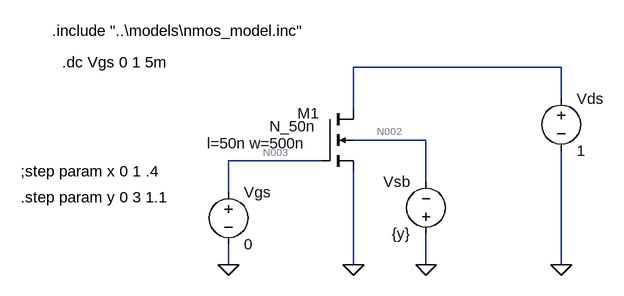
[diagram p0: schematic threshold_bodyeffects.asc]
threshold_bodyeffects.asc, the LTspice schematic file:
Version 4.1
SHEET 1 880 680
WIRE 560 64 240 64
WIRE 560 112 560 64
WIRE 240 128 240 64
WIRE 352 176 240 176
WIRE 192 208 48 208
WIRE 352 240 352 176
WIRE 48 256 48 208
WIRE 48 368 48 336
WIRE 240 368 240 224
WIRE 352 368 352 320
WIRE 560 368 560 192
FLAG 48 368 0
FLAG 240 368 0
FLAG 560 368 0
FLAG 352 368 0
SYMBOL nmos4 192 128 R0
WINDOW 0 -38 7 Left 2
WINDOW 3 -81 27 Left 2
WINDOW 123 -177 53 Left 2
SYMATTR InstName M1
SYMATTR Value N_50n
SYMATTR Value2 l=50n w=500n
SYMBOL voltage 48 240 R0
SYMATTR InstName Vgs
SYMATTR Value 0
SYMBOL voltage 560 96 R0
SYMATTR InstName Vds
SYMATTR Value 1
SYMBOL voltage 352 336 R180
WINDOW 0 24 96 Left 2
WINDOW 3 24 16 Left 2
SYMATTR InstName Vsb
SYMATTR Value {y}
TEXT -224 8 Left 2 !.include "..\\models\\nmos_model.inc"
TEXT -208 56 Left 2 !.dc Vgs 0 1 5m
TEXT -272 224 Left 2 !;step param x 0 1 .4
TEXT -272 264 Left 2 !.step param y 0 3 1.1

The netlist it stands for:
* threshold_bodyeffects.asc
M1 N001 N003 0 N002 N_50n l=50n w=500n
Vgs N003 0 0
Vds N001 0 1
Vsb 0 N002 {y}
.model NMOS NMOS
.model PMOS PMOS
.lib standard.mos
.include "..\models\nmos_model.inc"
.dc Vgs 0 1 5m
;step param x 0 1 .4
.step param y 0 3 1.1
.backanno
.end

* Results of the author's LTspice run, read from the files saved beside the schematic
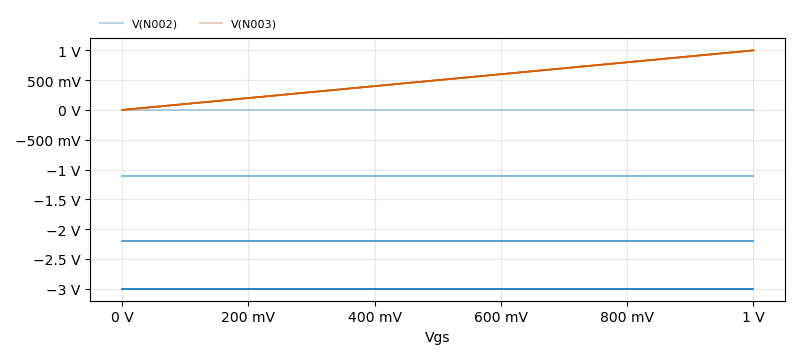
[diagram p1: DC transfer characteristic of threshold_bodyeffects.asc, plotted from the saved traces]
* DC transfer characteristic, 4 runs:
*   V(N002) [run 1]: 0 V at Vgs=0 V, 0 V at Vgs=1 V, min 0 V, max 0 V
*   V(N002) [run 2]: -1.1 V at Vgs=0 V, -1.1 V at Vgs=1 V, min -1.1 V, max -1.1 V
*   V(N002) [run 3]: -2.2 V at Vgs=0 V, -2.2 V at Vgs=1 V, min -2.2 V, max -2.2 V
*   V(N002) [run 4]: -3 V at Vgs=0 V, -3 V at Vgs=1 V, min -3 V, max -3 V
*   V(N003) [run 1]: 0 V at Vgs=0 V, 1 V at Vgs=1 V, min 0 V, max 1 V
*   V(N003) [run 2]: 0 V at Vgs=0 V, 1 V at Vgs=1 V, min 0 V, max 1 V
*   V(N003) [run 3]: 0 V at Vgs=0 V, 1 V at Vgs=1 V, min 0 V, max 1 V
*   V(N003) [run 4]: 0 V at Vgs=0 V, 1 V at Vgs=1 V, min 0 V, max 1 V